# Altium schematic sheet power.SchDoc
size A4; SheetNumber: 3; SheetTotal: 3
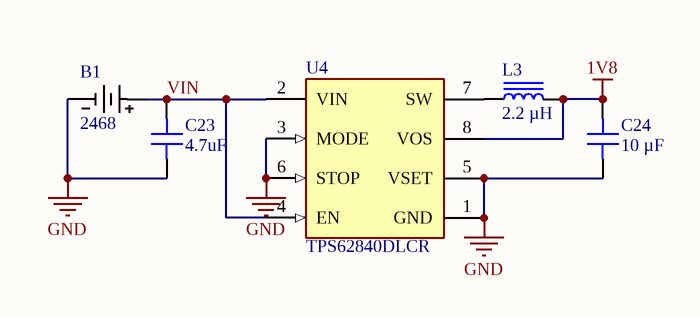
[diagram p0: power.SchDoc]

## Parts
B1  2468  [2468_KEY]
C23  4.7uF  [CAP 0603_1608]
C24  10 µF  [CAP 0603_1608]
L3  2.2 µH  [TDK VLS201612CX]
U4  TPS62840DLCR  [FP-DLC0008B-MFG]

## Nets
1V8: C24.2 L3.2 U4.8(VOS)
GND: B1.2 C23.1 C24.1 U4.1(GND) U4.3(MODE) U4.5(VSET) U4.6(STOP)
VIN: B1.1 C23.2 U4.2(VIN) U4.4(EN)
NetL3_1: L3.1 U4.7(SW)

## Library data of the parts
B1 = 2468: No Description Available; Mfr_Name: Keystone Electronics; Copyright: Copyright (C) 2022 Ultra Librarian. All rights reserved.; Manufacturer_Part_Number: 2468; RefDes: RefDes; Type: DEV
C23 = GRM188R60J106ME47D: CAP CER 10UF 6.3V X5R 0603; manufacturer: Murata Electronics; Capacitance: 10 µF; Tolerance: ±20%; Part Number: GRM188R60J106ME47D; Value: 4.7uF; Applications: General Purpose; componentlink1description: Datasheet; componentlink1url: https://www.murata.com/~/media/webrenewal/support/library/catalog/products/capacitor/mlcc/c02e.ashx?la=en-us; componentlink2description: DigiKey Link; componentlink2url: https://www.digikey.com/en/products/detail/murata-electronics/GRM188R60J106ME47D/965910; Device Package: 0603 (1608 Metric); lastupdated: 11/9/2022 9:40:24 am; Lifecycle Status: Active; Minimum Order: 1; Mounting Type: Surface Mount, MLCC; Operating Temperature: -55°C ~ 85°C; Package / Case: 0603 (1608 Metric); packaging: TapeAndReel; partid: 2351; Part Status: Active; price: 0.02; series: GRM; Size / Dimension: 0.063" L x 0.031" W (1.60mm x 0.80mm); Supplier 1: DigiKey; Supplier Part Number 1: 490-3896-1-ND; Temperature Coefficient: X5R; Thickness (Max): 0.035" (0.90mm); Voltage - Rated: 6.3V
C24 = GRM188R60J106ME47D: CAP CER 10UF 6.3V X5R 0603; manufacturer: Murata Electronics; Tolerance: ±20%; Part Number: GRM188R60J106ME47D; Value: 10 µF; Applications: General Purpose; Capacitance: 10 µF; componentlink1description: Datasheet; componentlink1url: https://www.murata.com/~/media/webrenewal/support/library/catalog/products/capacitor/mlcc/c02e.ashx?la=en-us; componentlink2description: DigiKey Link; componentlink2url: https://www.digikey.com/en/products/detail/murata-electronics/GRM188R60J106ME47D/965910; Device Package: 0603 (1608 Metric); lastupdated: 11/9/2022 9:40:24 am; Lifecycle Status: Active; Minimum Order: 1; Mounting Type: Surface Mount, MLCC; Operating Temperature: -55°C ~ 85°C; Package / Case: 0603 (1608 Metric); packaging: TapeAndReel; partid: 2351; Part Status: Active; price: 0.02; series: GRM; Size / Dimension: 0.063" L x 0.031" W (1.60mm x 0.80mm); Supplier 1: DigiKey; Supplier Part Number 1: 490-3896-1-ND; Temperature Coefficient: X5R; Thickness (Max): 0.035" (0.90mm); Voltage - Rated: 6.3V
L3 = VLS201612CX-6R8M-1: FIXED IND 6.8UH 930MA 368MOHM SM; Manufacturer: TDK Corporation; Current - Saturation: 730mA; DC Resistance (DCR): 368mOhm Max; Inductance: 6.8 µH; Inductance Frequency - Test: 1 MHz; Material - Core: Ferrite; Shielding: Shielded; Tolerance: ±20%; Type: Drum Core, Wirewound; Part Number: VLS201612CX-6R8M-1; ComponentLink1Description: Datasheet; ComponentLink1URL: https://product.tdk.com/info/en/catalog/datasheets/inductor_commercial_power_vls201612cx-1_en.pdf?ref_disty=digikey; ComponentLink2Description: DigiKey Link; ComponentLink2URL: https://www.digikey.com/en/products/detail/tdk-corporation/VLS201612CX-6R8M-1/5169771; Current Rating (Amps): 930 mA; Device Package: Nonstandard; Height - Seated (Max): 0.047" (1.20mm); LastUpdated: 11/9/2022 10:31:03 am; Lifecycle Status: Active; Minimum Order: 1; Mounting Type: Surface Mount; Operating Temperature: -40°C ~ 105°C; Package / Case: Nonstandard; Packaging: TapeAndReel; PartId: 207; Part Status: Active; Price: 0.13; Series: VLS-CX-1; Size / Dimension: 0.079" L x 0.063" W (2.00mm x 1.60mm); Supplier 1: DigiKey; Supplier Part Number 1: 445-172966-1-ND; Supplier Device Package: 2016; Value: 2.2 µH
U4 = CMP-04918-000086-1: ULTRA LOW IQ BUCK CONVERTER; Manufacturer: Texas Instruments; Standoff Height: 0mm; Nominal Supply Current: 0.005-3000uA; Switching Frequency: 1.8MHz; Max Duty Cycle: 100%; Min Supply Voltage: 1.8V; Output Current: 750mA; Max Supply Voltage: 6.5V; Max Junction Temp: +125°C; Output Type: AdjustableProgrammable; Output Voltage: 1.8-3.3V; Number Of Outputs: 1; Device Class L1: Integrated Circuits (ICs); Device Class L3: Voltage Regulators - Switching; RoHS: TRUE; Automotive: No; Package: DLC0008B; ComponentLink2URL: http://www.ti.com/lit/ds/symlink/tps62840.pdf; Height: 1mm; Lead Free: Yes; Octopart: https://octopart.com/tps62840dlcr-texas+instruments-103121111; Mouser Description: 60-nA IQ, 1.8-V to 6.5-VIN, high-efficiency 750-mA step-down converter 8-VSON-HR -40 to 125; Manufacturer Part Number: TPS62840DLCR; Ipc Land Pattern Name: DFN200X150X100-8; Temperature: -40°C to +125°C; ComponentLink2Description: Datasheet; Switching Topology: Buck; Temperature Range Low: -40°C; Device Class L2: Power Management ICs; Temperature Range High: +125°C; Digikey Description: ULTRA LOW IQ BUCK CONVERTER; Category: IC